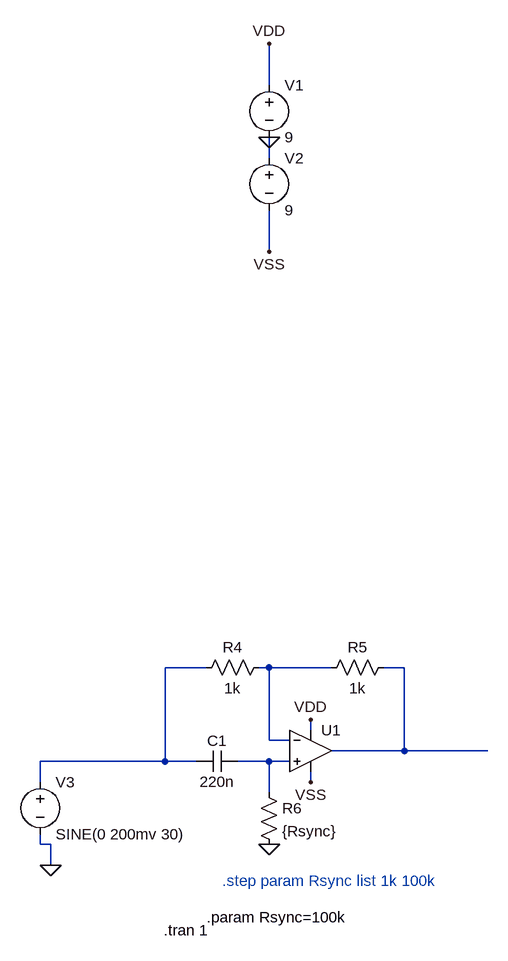
[diagram p0: schematic LockIn_Verstärke2r.asc]
LockIn_Verstärke2r.asc, the LTspice schematic file:
Version 4
SHEET 1 1580 1412
WIRE -576 -288 -576 -352
WIRE -576 -176 -576 -208
WIRE -576 -32 -576 -96
WIRE -672 608 -736 608
WIRE -576 608 -592 608
WIRE -480 608 -576 608
WIRE -368 608 -400 608
WIRE -512 704 -512 688
WIRE -576 720 -576 608
WIRE -544 720 -576 720
WIRE -368 736 -368 608
WIRE -368 736 -480 736
WIRE -240 736 -368 736
WIRE -736 752 -736 608
WIRE -736 752 -928 752
WIRE -688 752 -736 752
WIRE -576 752 -624 752
WIRE -544 752 -576 752
WIRE -928 784 -928 752
WIRE -512 784 -512 768
WIRE -576 800 -576 752
WIRE -928 880 -928 864
WIRE -912 880 -928 880
WIRE -912 912 -912 880
FLAG -576 -208 0
FLAG -576 -32 VSS
FLAG -576 -352 VDD
FLAG -512 688 VDD
FLAG -512 784 VSS
FLAG -576 880 0
FLAG -912 912 0
SYMBOL voltage -576 -304 R0
WINDOW 123 0 0 Left 2
WINDOW 39 0 0 Left 2
SYMATTR InstName V1
SYMATTR Value 9
SYMBOL voltage -576 -192 R0
WINDOW 123 0 0 Left 2
WINDOW 39 0 0 Left 2
SYMATTR InstName V2
SYMATTR Value 9
SYMBOL res -576 592 R90
WINDOW 0 0 56 VBottom 2
WINDOW 3 32 56 VTop 2
SYMATTR InstName R4
SYMATTR Value 1k
SYMBOL res -384 592 R90
WINDOW 0 0 56 VBottom 2
WINDOW 3 32 56 VTop 2
SYMATTR InstName R5
SYMATTR Value 1k
SYMBOL res -592 784 R0
SYMATTR InstName R6
SYMATTR Value {Rsync}
SYMBOL cap -624 736 R90
WINDOW 0 0 32 VBottom 2
WINDOW 3 32 32 VTop 2
SYMATTR InstName C1
SYMATTR Value 220n
SYMBOL Opamps\\UniversalOpamp2 -512 736 R0
SYMATTR InstName U1
SYMBOL voltage -928 768 R0
WINDOW 123 0 0 Left 2
WINDOW 39 0 0 Left 2
SYMATTR InstName V3
SYMATTR Value SINE(0 200mv 30)
TEXT -672 992 Left 2 !.param Rsync=100k
TEXT -738 1012 Left 2 !.tran 1
TEXT -648 936 Left 2 ;.step param Rsync list 1k 100k

The netlist it stands for:
* LockIn_Verstärke2r.asc
V1 VDD 0 9
V2 0 VSS 9
R4 N002 N001 1k
R5 N003 N002 1k
R6 N004 0 {Rsync}
C1 N004 N001 220n
XU1 N004 N002 VDD VSS N003 level.2 Avol=1Meg GBW=10Meg Slew=10Meg ilimit=25m rail=0 Vos=0 phimargin=45 en=0 enk=0 in=0 ink=0 Rin=500Meg  ; pins IN+ IN- V+ V- OUT
V3 N001 0 SINE(0 200mv 30)
.param Rsync=100k
.tran 1
* .step param Rsync list 1k 100k
.lib UniversalOpamps2.sub
.backanno
.end